# EAGLE design oprom-ide (EAGLE 9.6.2)
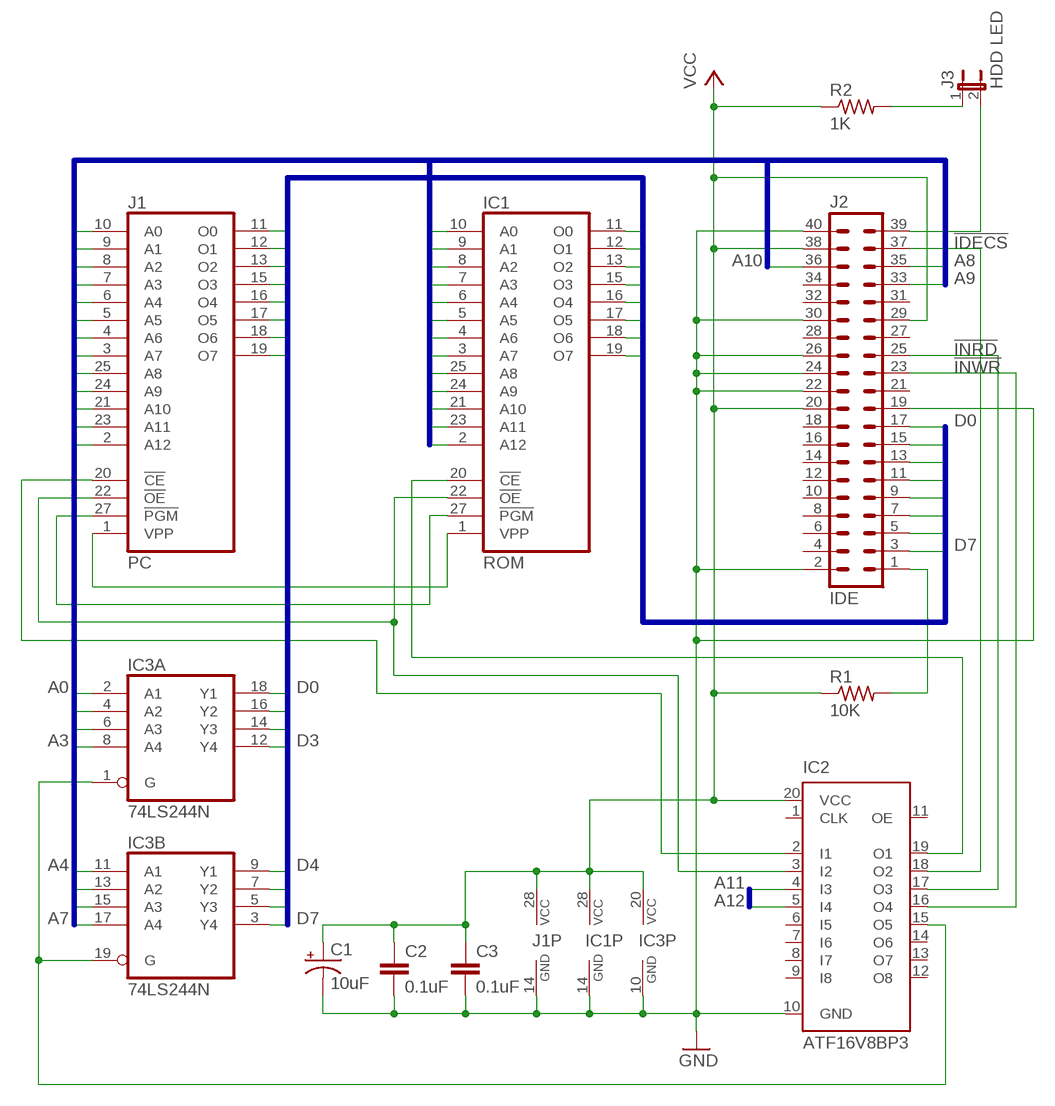
[diagram p0: schematic, sheet 1]

## Parts
C1  10uF  CPOL-USE2.5-6  [E2,5-6]
C2  0.1uF  C-EU050-024X044  [C050-024X044]
C3  0.1uF  C-EU050-024X044  [C050-024X044]
IC1  ROM  2764  [DIL28]
IC2  ATF16V8BP3  [DIL20]
IC3  74LS244N  [DIL20]
J1  PC  2764  [DIL28]
J2  IDE  MA20-2W  [MA20-2W]
J3  HDD LED  JP1E  [JP1]
R1  10K  R-US_0204/7  [0204/7]
R2  1K  R-US_0204/7  [0204/7]

## Nets
!ATOD: IC2.15(O5) IC3.1(A:G) IC3.19(B:G)
!EXCS: IC2.2(I1) J1.20(!CE)
!EXRD: IC1.22(!OE) IC2.3(I2) J1.22(!OE)
!EXWR: IC1.27(!PGM) J1.27(!PGM)
!IDECS: IC2.18(O2) J2.37
!IDELED: J2.39 J3.2
!INRD: IC2.17(O3) J2.25
!INWR: IC2.16(O4) J2.23
!RESET: J2.1 R1.2
!ROMCS: IC1.20(!CE) IC2.19(O1)
A0: IC1.10(A0) IC3.2(A:A1) J1.10(A0)
A1: IC1.9(A1) IC3.4(A:A2) J1.9(A1)
A2: IC1.8(A2) IC3.6(A:A3) J1.8(A2)
A3: IC1.7(A3) IC3.8(A:A4) J1.7(A3)
A4: IC1.6(A4) IC3.11(B:A1) J1.6(A4)
A5: IC1.5(A5) IC3.13(B:A2) J1.5(A5)
A6: IC1.4(A6) IC3.15(B:A3) J1.4(A6)
A7: IC1.3(A7) IC3.17(B:A4) J1.3(A7)
A8: IC1.25(A8) J1.25(A8) J2.35
A9: IC1.24(A9) J1.24(A9) J2.33
A10: IC1.21(A10) J1.21(A10) J2.36
A11: IC1.23(A11) IC2.4(I3) J1.23(A11)
A12: IC1.2(A12) IC2.5(I4) J1.2(A12)
D0: IC1.11(O0) IC3.18(A:Y1) J1.11(O0) J2.17
D1: IC1.12(O1) IC3.16(A:Y2) J1.12(O1) J2.15
D2: IC1.13(O2) IC3.14(A:Y3) J1.13(O2) J2.13
D3: IC1.15(O3) IC3.12(A:Y4) J1.15(O3) J2.11
D4: IC1.16(O4) IC3.9(B:Y1) J1.16(O4) J2.9
D5: IC1.17(O5) IC3.7(B:Y2) J1.17(O5) J2.7
D6: IC1.18(O6) IC3.5(B:Y3) J1.18(O6) J2.5
D7: IC1.19(O7) IC3.3(B:Y4) J1.19(O7) J2.3
GND: C1.- C2.2 C3.2 IC1.14(GND) IC2.10(GND) IC3.10(P:GND) J1.14(GND) J2.2 J2.19 J2.22 J2.24 J2.26 J2.30 J2.40
IDELEDP: J3.1 R2.2
VCC: C1.+ C2.1 C3.1 IC1.28(VCC) IC2.20(VCC) IC3.20(P:VCC) J1.28(VCC) J2.20 J2.29 J2.38 R1.1 R2.1
VPP: IC1.1(VPP) J1.1(VPP)
Unconnected: IC2.1(CLK) IC2.6(I5) IC2.7(I6) IC2.8(I7) IC2.9(I8) IC2.11(OE) IC2.12(O8) IC2.13(O7) IC2.14(O6) J2.4 J2.6 J2.8 J2.10 J2.12 J2.14 J2.16 J2.18 J2.21 J2.27 J2.28 J2.31 J2.32 J2.34

## Buses
D[0..7]
A[0..12]

## Library data of the parts
C1 = rcl:CPOL-US: POLARIZED CAPACITOR, American symbol; SPICEPREFIX: C
C2 C3 = rcl:C-EU: CAPACITOR, European symbol; SPICEPREFIX: C
IC1 J1 = memory:2764: MEMORY
IC2 = atmel:ATF16V8B: High perfomance CMOS (electrically erasable) programmable logic device (PLD) ABLE-Atmel-ABEL - P18V8R, P16V8C, P16V8AS, P17V8 COPL Atmel-WinCUPL - G16V8MS, G16V8MA, G16V8AS, G16V8 LOG/IC - GAL16V8_R, GAL16V8_G7, GAL16V8_C), GAL16V8 Tango-PLD - G16V8R, G16V8C, G16V8AS, G16V8 Source: http://www.atmel.com/dyn/resources/prod_documents/DOC0364.PDF; MPN: ATF16V8CZ-15PU; OC_FARNELL: 1551768; OC_NEWARK: 94M6254
IC3 = 74xx-eu:74*244: Octal BUFFER and LINE DRIVER, 3-state
J2 = con-lstb:MA20-2W: PIN HEADER; OC_FARNELL: unknown; OC_NEWARK: unknown
J3 = jumper:JP1E: JUMPER
R1 R2 = rcl:R-US_: RESISTOR, American symbol; SPICEPREFIX: R

## Board
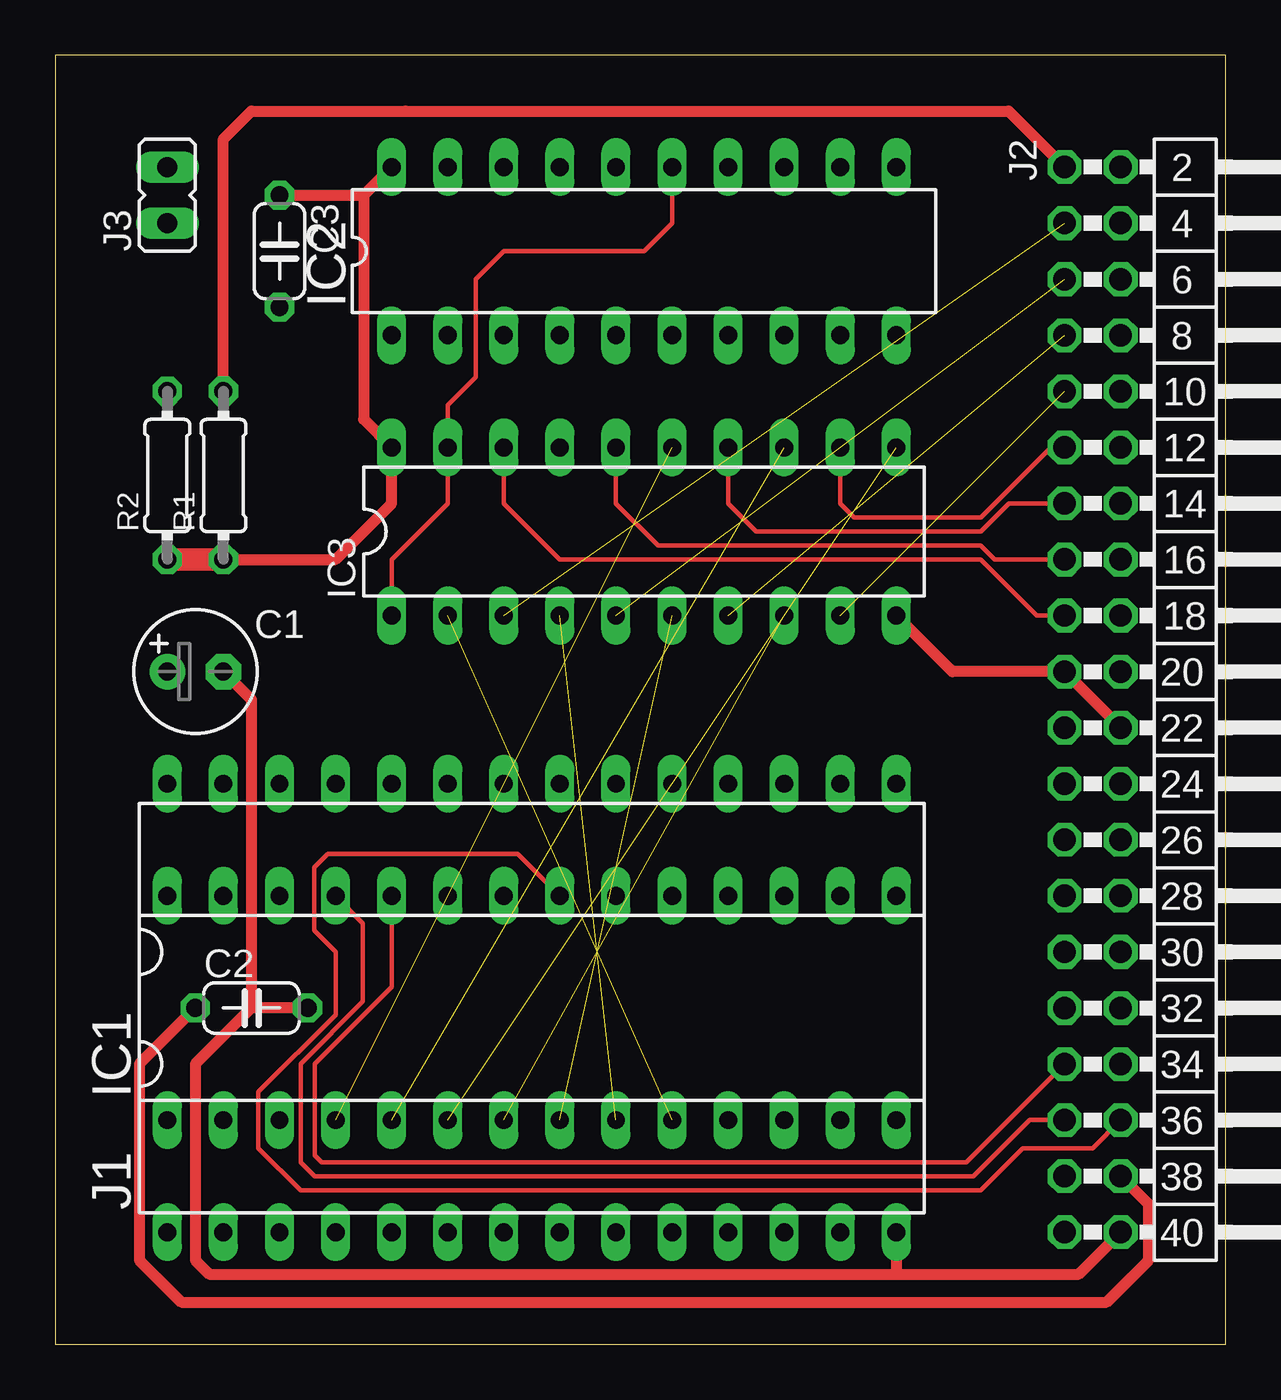
[diagram p1: board, top side]
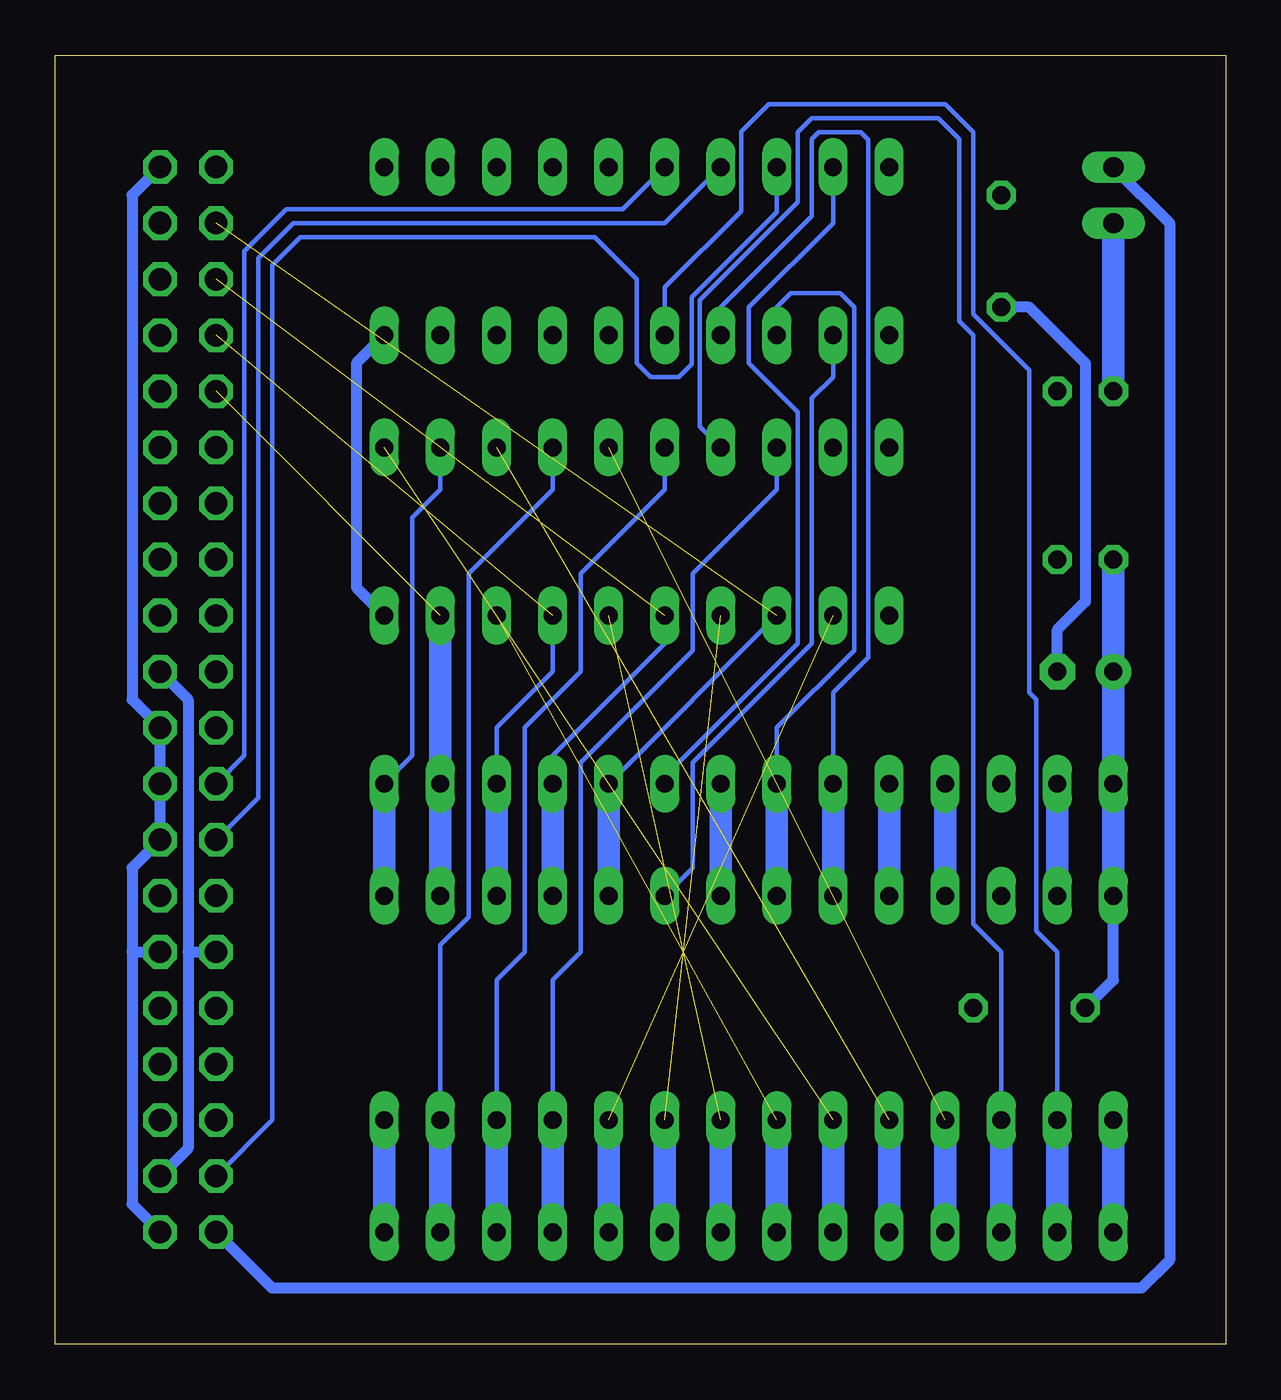
[diagram p2: board, bottom side, seen from below]

Size 53.01 x 58.41 mm. Coordinates in mm from the lower left corner, seen from the top.
Outline: 0,0 53.01,0 53.01,58.41 0,58.41 0,0
Copper layers (1*16): Top 0.035mm / dielectric 1.5mm / Bottom 0.035mm
Design rules "default": minimum track width 6mil, minimum drill 0.35mm, track to track 6mil, track to pad 6mil, pad to pad 6mil, via to via 6mil, smd to smd 6mil, copper to edge 40mil, drill to drill 6mil, minimum pad ring 10mil, minimum via ring 8mil, stop-mask expansion 4mil, vias tented up to drill 0mil, thermal gap 10mil

### Footprints (pad centres in the part's own frame; a part is rotated, then mirrored left to right if it is on the bottom)
E2,5-6 = drill 0.813 pad 1.6: + -1.27,0 | drill 0.813 pad 1.6 octagon: - 1.27,0
C050-024X044 = drill 0.813 octagon: 1 -2.54,0; 2 2.54,0
DIL28 = drill 0.813 long: 1 -16.51,-7.62; 2 -13.97,-7.62; 3 -11.43,-7.62; 4 -8.89,-7.62; 5 -6.35,-7.62; 6 -3.81,-7.62; 7 -1.27,-7.62; 8 1.27,-7.62; 9 3.81,-7.62; 10 6.35,-7.62; 11 8.89,-7.62; 12 11.43,-7.62; 13 13.97,-7.62; 14 16.51,-7.62; 15 16.51,7.62; 16 13.97,7.62; 17 11.43,7.62; 18 8.89,7.62; 19 6.35,7.62; 20 3.81,7.62; 21 1.27,7.62; 22 -1.27,7.62; 23 -3.81,7.62; 24 -6.35,7.62; 25 -8.89,7.62; 26 -11.43,7.62; 27 -13.97,7.62; 28 -16.51,7.62
DIL20 = drill 0.813 long: 1 -11.43,-3.81; 2 -8.89,-3.81; 3 -6.35,-3.81; 4 -3.81,-3.81; 5 -1.27,-3.81; 6 1.27,-3.81; 7 3.81,-3.81; 8 6.35,-3.81; 9 8.89,-3.81; 10 11.43,-3.81; 11 11.43,3.81; 12 8.89,3.81; 13 6.35,3.81; 14 3.81,3.81; 15 1.27,3.81; 16 -1.27,3.81; 17 -3.81,3.81; 18 -6.35,3.81; 19 -8.89,3.81; 20 -11.43,3.81
MA20-2W = drill 1.016 octagon: 1 -24.13,-1.27; 2 -24.13,1.27; 3 -21.59,-1.27; 4 -21.59,1.27; 5 -19.05,-1.27; 6 -19.05,1.27; 7 -16.51,-1.27; 8 -16.51,1.27; 9 -13.97,-1.27; 10 -13.97,1.27; 11 -11.43,-1.27; 12 -11.43,1.27; 13 -8.89,-1.27; 14 -8.89,1.27; 15 -6.35,-1.27; 16 -6.35,1.27; 17 -3.81,-1.27; 18 -3.81,1.27; 19 -1.27,-1.27; 20 -1.27,1.27; 21 1.27,-1.27; 22 1.27,1.27; 23 3.81,-1.27; 24 3.81,1.27; 25 6.35,-1.27; 26 6.35,1.27; 27 8.89,-1.27; 28 8.89,1.27; 29 11.43,-1.27; 30 11.43,1.27; 31 13.97,-1.27; 32 13.97,1.27; 33 16.51,-1.27; 34 16.51,1.27; 35 19.05,-1.27; 36 19.05,1.27; 37 21.59,-1.27; 38 21.59,1.27; 39 24.13,-1.27; 40 24.13,1.27
JP1 = drill 0.914 long: 1 0,-1.27; 2 0,1.27
0204/7 = drill 0.813 octagon: 1 -3.81,0; 2 3.81,0

### Placement (x,y rotation side)
C1  6.35,30.48 0 top
C2  8.89,15.24 0 top
C3  10.16,49.53 270 top
IC1  21.59,17.78 0 top
IC2  26.67,49.53 0 top
IC3  26.67,36.83 0 top
J1  21.59,12.7 0 top
J2  46.99,29.21 270 top
J3  5.08,52.07 0 top
R1  7.62,39.37 90 top
R2  5.08,39.37 90 top

### Tracks (layer width: path | path; a pad name or v marks a point on that pad's centre or on a via)
!ATOD
  Top 0.203: IC2.15 27.94,50.8 26.67,49.53 20.32,49.53 19.05,48.26 19.05,43.81 17.78,42.55 IC3.19 17.78,38.1 15.24,35.56 IC3.1
!EXCS
  Bottom 0.203: IC2.2 17.78,43.81 18.73,42.86 18.73,31.75 24.13,26.35 24.13,21.59 J1.20
!EXRD
  Bottom 0.203: IC1.22 20.32,27.94 16.83,31.43 16.83,46.99 17.46,47.62 19.68,47.62 20.32,46.99 IC2.3
  Bottom 1.016: IC1.22 J1.22
!EXWR
  Bottom 1.016: J1.27 IC1.27
!IDECS
  Bottom 0.203: J2.37 43.18,10.16 43.18,48.9 41.91,50.16 28.57,50.16 26.67,48.26 26.67,44.45 26.04,43.81 24.77,43.81 24.17,44.41 24.17,47.45 20.32,51.3 IC2.18
!IDELED
  Bottom 0.508: J3.2 2.54,50.8 2.54,3.81 3.81,2.54 43.18,2.54 J2.39
!INRD
  Bottom 0.203: J2.25 43.81,24.77 43.81,49.21 42.23,50.8 25.4,50.8 IC2.17
!INWR
  Bottom 0.203: J2.23 44.45,26.67 44.45,49.53 42.55,51.44 27.3,51.44 IC2.16
!RESET
  Top 0.508: R1.2 7.62,54.61 8.89,55.88 15.88,55.88 43.18,55.88 J2.1
!ROMCS
  Bottom 0.203: IC1.20 25.4,25.72 19.37,31.75 19.37,42.23 21.59,44.45 21.59,46.99 17.78,50.8 IC2.19
A0  (1 unrouted)
  Bottom 1.016: J1.10 IC1.10
A1  (1 unrouted)
  Bottom 1.016: J1.9 IC1.9
A2  (1 unrouted)
  Bottom 1.016: J1.8 IC1.8
A3  (1 unrouted)
  Bottom 1.016: J1.7 IC1.7
A4  (1 unrouted)
  Bottom 1.016: J1.6 IC1.6
A5  (1 unrouted)
  Bottom 1.016: J1.5 IC1.5
A6  (1 unrouted)
  Bottom 1.016: J1.4 IC1.4
A7
  Bottom 0.203: IC1.3 10.16,17.78 11.43,19.05 11.43,45.72 12.06,46.35 12.06,54.61 13.02,55.56 18.73,55.56 19.37,54.93 19.37,51.75 23.81,47.31 23.81,41.59 IC3.17
  Bottom 1.016: J1.3 IC1.3
A8
  Top 0.203: J1.25 13.94,19.08 13.94,15.53 11.11,12.7 11.11,8.26 11.75,7.62 41.59,7.62 44.13,10.16 J2.35
  Bottom 1.016: J1.25 IC1.25
A9
  Top 0.203: J1.24 15.24,16.19 11.75,12.7 11.75,8.57 12.06,8.26 41.27,8.26 J2.33
  Bottom 1.016: IC1.24 J1.24
A10
  Top 0.203: J1.21 20.95,22.23 12.33,22.23 11.72,21.61 11.72,18.76 12.7,17.78 12.7,14.92 9.21,11.43 9.21,8.89 11.11,6.99 41.91,6.99 43.81,8.89 46.99,8.89 J2.36
  Bottom 1.016: J1.21 IC1.21
A11
  Bottom 0.203: IC1.23 17.78,29.53 16.19,31.11 16.19,54.57 16.54,54.91 18.43,54.91 18.73,54.61 18.73,51.12 22.86,46.99 IC2.4
  Bottom 1.016: J1.23 IC1.23
A12
  Bottom 0.203: IC1.2 7.62,17.78 8.57,18.73 8.57,29.21 8.89,29.53 8.89,44.13 11.43,46.67 11.43,54.93 12.7,56.2 20.69,56.2 21.95,54.94 21.95,51.35 25.4,47.89 IC2.5
  Bottom 1.016: J1.2 IC1.2
D0
  Top 0.203: J2.17 44.45,33.02 41.91,35.56 22.86,35.56 20.32,38.1 IC3.18
  Bottom 0.203: IC1.11 30.48,16.51 29.21,17.78 29.21,26.35 24.13,31.43 24.13,34.92 20.32,38.73 IC3.18
  Bottom 1.016: J1.11 IC1.11
D1
  Top 0.203: J2.15 42.55,35.56 41.91,36.2 27.3,36.2 25.4,38.1 IC3.16
  Bottom 0.203: IC1.12 33.02,16.51 31.75,17.78 31.75,27.94 29.21,30.48 29.21,34.92 25.4,38.73 IC3.16
  Bottom 1.016: J1.12 IC1.12
D2
  Top 0.203: J2.13 43.18,38.1 41.91,36.83 31.75,36.83 30.48,38.1 IC3.14
  Bottom 0.203: IC1.13 35.56,18.1 34.29,19.37 34.29,34.92 30.48,38.73 IC3.14
  Bottom 1.016: J1.13 IC1.13
D3
  Top 0.203: J2.11 45.09,40.64 41.91,37.47 36.2,37.47 35.56,38.1 IC3.12
  Bottom 0.203: IC1.15 36.83,26.67 36.83,37.47 35.56,38.73 IC3.12
  Bottom 1.016: IC1.15 J1.15
D4  (1 unrouted)
  Bottom 1.016: J1.16 IC1.16 IC3.9
D5  (1 unrouted)
  Bottom 0.203: IC3.7 30.48,30.48 33.02,27.94 IC1.17
  Bottom 1.016: J1.17 IC1.17
D6  (1 unrouted)
  Bottom 0.203: IC3.5 25.4,31.75 30.48,26.67 IC1.18
  Bottom 1.016: IC1.18 J1.18
D7  (1 unrouted)
  Bottom 0.203: IC1.19 IC3.3
  Bottom 1.016: J1.19 IC1.19
GND
  Top 0.508: 8.89,15.24 6.35,12.7 6.35,3.81 6.99,3.17 38.1,3.17 | J1.14 38.1,3.17 | 38.1,3.17 46.35,3.17 J2.40 | IC3.10 40.64,30.48 J2.19 J2.22 | C1.- 8.89,29.21 8.89,15.24 | C2.2 8.89,15.24
  Bottom 0.508: C1.- 7.62,32.38 6.35,33.66 6.35,44.45 8.89,46.99 C3.2 | J2.40 49.53,6.35 49.53,17.78 | 49.53,17.78 49.53,21.59 J2.26 J2.24 J2.22 49.53,29.21 49.53,52.07 J2.2 | 49.53,17.78 J2.30 | IC2.10 39.37,44.45 39.37,34.29 IC3.10
  Bottom 1.016: J1.14 IC1.14
IDELEDP
  Bottom 1.016: R2.2 J3.1
VCC
  Top 0.508: R1.1 12.7,35.56 15.24,38.1 IC3.20 13.97,41.91 13.97,52.07 | C2.1 3.81,12.7 3.81,3.81 5.71,1.91 47.62,1.91 49.53,3.81 49.53,6.35 J2.38 | IC2.20 13.97,52.07 | C3.1 13.97,52.07
  Top 1.016: R2.1 R1.1
  Bottom 0.508: J2.20 46.99,29.21 46.99,17.78 | 46.99,17.78 46.99,8.89 J2.38 | 46.99,17.78 J2.29 | C2.1 5.08,16.51 J1.28
  Bottom 1.016: J1.28 IC1.28 C1.+ R2.1
VPP
  Bottom 1.016: J1.1 IC1.1